# Altium schematic sheet C210_0006_Power_220601.SchDoc: C210_0006_Power
size B; Date: 2/26/2021; CompanyName: U-blox; DrawnBy: EMOO; Engineer: EMOO; Organization: U-blox; Address1: 2601 25th St. SE; Address2: Salem, OR 97302; SheetNumber: 6; SheetTotal: 7; Website: www.u-blox.com; SheetSize: B; SheetTitle: C-210 Power
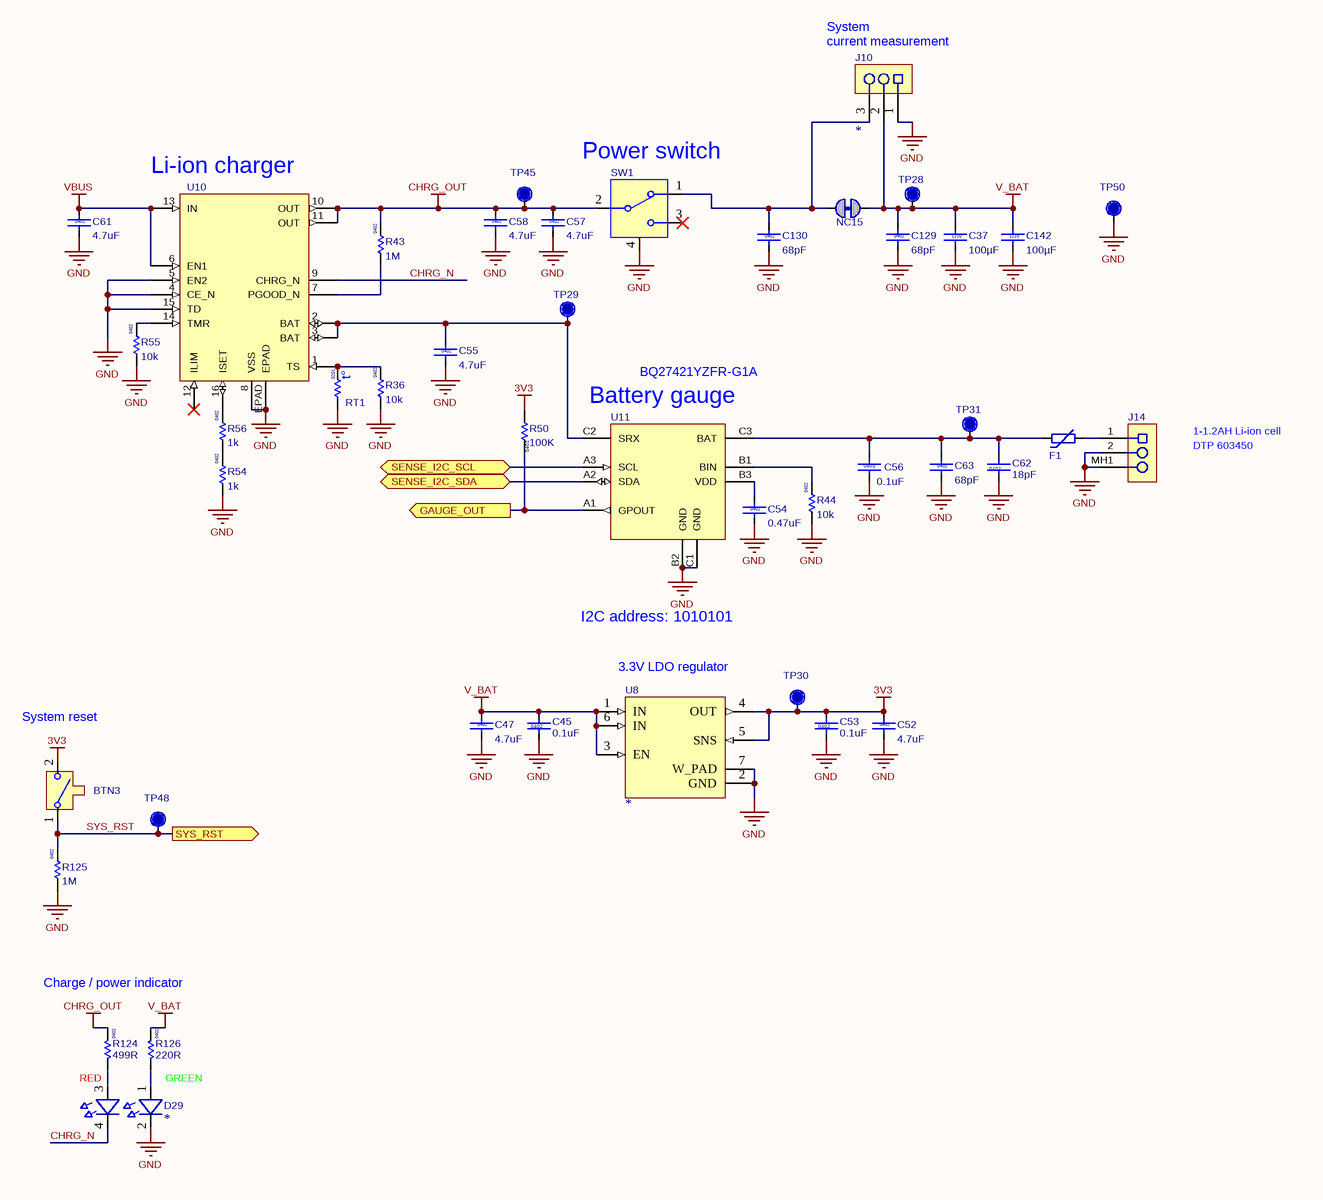
[diagram p0: C210_0006_Power_220601.SchDoc]

## Parts
?  (no value)  (graphical)
BTN3  (no value)  [B3U-3000P]
C37  value 100µF  Size: 1210  [Cap 1210]
C45  value 0.1uF  Size: 0402  [Cap 0402 HD]  (hidden comment: 120-000160.1uF)
C47  value 4.7uF  Size: 0402  [Cap 0402 HD]
C52  value 4.7uF  Size: 0402  [Cap 0402 HD]
C53  value 0.1uF  Size: 0402  [Cap 0402 HD]  (hidden comment: 120-000160.1uF)
C54  value 0.47uF  Size: 0402  [Cap 0402 HD]
C55  value 4.7uF  Size: 0402  [Cap 0402 HD]
C56  value 0.1uF  Size: 0402  [Cap 0402 HD]  (hidden comment: 120-000160.1uF)
C57  value 4.7uF  Size: 0402  [Cap 0402 HD]
C58  value 4.7uF  Size: 0402  [Cap 0402 HD]
C61  value 4.7uF  Size: 0402  [Cap 0402 HD]
C62  value 18pF  Size: 0402  [Cap 0402 HD]
C63  value 68pF  Size: 0402  [Cap 0402 HD]
C129  value 68pF  Size: 0402  [Cap 0402 HD]
C130  value 68pF  Size: 0402  [Cap 0402 HD]
C142  value 100µF  Size: 1210  [Cap 1210]
D29  (no value)  [LED_4Pin_4213_RA_3215]
F1  (no value)  [Fuse 1206]
J10  (no value)  [HDR-0.1P-3Pin-1Row-SMT]
J14  (no value)  [S2B-PH-SM4-TB]
NC15  Solderbridge-ShortDNP  [Solderbridge-Short]  (value not drawn)  (net tie, no BOM)
R36  value 10k  Size: 0402  [RES 0402 HD]
R43  value 1M  Size: 0402  [RES 0402 HD]
R44  value 10k  Size: 0402  [RES 0402 HD]
R50  value 100K  Size: 0402  [RES 0402 HD]
R54  value 1k  Size: 0402  [RES 0402 HD]
R55  value 10k  Size: 0402  [RES 0402 HD]
R56  value 1k  Size: 0402  [RES 0402 HD]
R124  value 499R  Size: 0402  [RES 0402 HD]
R125  value 1M  Size: 0402  [RES 0402 HD]
R126  value 220R  Size: 0402  [RES 0402 HD]
RT1  Size: 0201  [RES 0201 HD]  (hidden comment: Res Thermal)
SW1  (no value)  [EG1224]
TP28  TP  [TP12R]  (value not drawn)  (no BOM)
TP29  TP  [TP12R]  (value not drawn)  (no BOM)
TP30  TP  [TP12R]  (value not drawn)  (no BOM)
TP31  TP  [TP12R]  (value not drawn)  (no BOM)
TP45  TP  [TP12R]  (value not drawn)  (no BOM)
TP48  TP  [TP12R]  (value not drawn)  (no BOM)
TP50  TP  [TP12R]  (value not drawn)  (no BOM)
U8  (no value)  [DFN0.95P-6Pin_W-Pad]
U10  bq24230  [QFN0.5P3x3-16Pin_W-Pad]  (value not drawn)
U11  (no value)  [BQ27421]

## Ports
GAUGE_OUT (out), SENSE_I2C_SCL (bidir), SENSE_I2C_SDA (bidir), SYS_RST (out)

## Nets
3V3: BTN3.2 C52.1 C53.2 R50.1 TP30.1 U8.4(OUT) U8.5(SNS)
CHRG_OUT: C57.1 C58.1 R43.2 R124.2 SW1.2 TP45.1 U10.10(OUT) U10.11(OUT)
GND: C37.2 C45.1 C47.2 C52.2 C53.1 C54.2 C55.2 C56.1 C57.2 C58.2 C61.2 C62.1 C63.2 C129.2 C130.2 C142.2 D29.2(C1) J10.1 J14.2 J14.MH1 R36.1 R44.1 R54.1 R55.1 R125.1 RT1.2 SW1.4(GND) TP50.1 U8.2(GND) U8.7(W_PAD) U10.4(CE_N) U10.5(EN2) U10.8(VSS) U10.15(TD) U10.EPAD U11.B2(GND) U11.C1(GND)
V_BAT: C37.1 C45.2 C47.1 C129.1 C142.1 J10.2 NC15.1 R126.2 TP28.1 U8.1(IN) U8.3(EN) U8.6(IN)
VBUS: C61.1 U10.6(EN1) U10.13(IN)
CHRG_N: D29.4(C2) U10.9(CHRG_N)
GAUGE_OUT: R50.2 U11.A1(GPOUT) ; port GAUGE_OUT
SENSE_I2C_SCL: U11.A3(SCL) ; port SENSE_I2C_SCL
SENSE_I2C_SDA: U11.A2(SDA) ; port SENSE_I2C_SDA
SYS_RST: BTN3.1 R125.2 TP48.1 ; port SYS_RST
NetC54_1: C54.1 U11.B3(VDD)
NetC55_1: C55.1 TP29.1 U10.2(BAT) U10.3(BAT) U11.C2(SRX)
NetC56_2: C56.2 C62.2 C63.1 F1.1 TP31.1 U11.C3(BAT)
NetC130_1: C130.1 J10.3 NC15.2 SW1.1
NetD29_1: D29.1(A1) R126.1
NetD29_3: D29.3(A2) R124.1
NetF1_2: F1.2 J14.1
NetR36_2: R36.2 RT1.1 U10.1(TS)
NetR43_1: R43.1 U10.7(PGOOD_N)
NetR44_2: R44.2 U11.B1(BIN)
NetR54_2: R54.2 R56.1
NetR55_2: R55.2 U10.14(TMR)
NetR56_2: R56.2 U10.16(ISET)

Not connected (* = marked no-connect by the designer): SW1 3*; U10 12(ILIM)*

## Notes on the sheet
- System
- (near J10) current measurement
- (near SW1) Power switch
- (near U10) Li-ion charger
- BQ27421YZFR-G1A
- (near U11) Battery gauge
- DTP 603450
- 1-1.2AH Li-ion cell
- I2C address: 1010101
- (near BTN3) System reset
- (near U8) 3.3V LDO regulator
- Charge / power indicator
- RED
- GREEN
- Revision:
- Page:
- (in symbol 182-00002) t°

## Library data of the parts
? = Sub_Title_Block: Minimized schematic title block for all subset sheets
BTN3 = 135-00006: Button SPST-NO Off-MOM, 50mA 12V, Right Angle, SMT; Manufacturer 1: Omron Electronics Inc-EMC Div; Part Name: Button Tactile SPST-NO 50mA 3mm RA SMT; Body Size: 3.00mm x 2.50mm; Item Phase: In Production; Use in new designs: Yes; Voltage: 12VDC; UBX Code: None; Part Number: 135-00006; Manufacturer Part Number 1: B3U-3000P; Supplier 1: Digi-Key; Supplier Part Number 1: SW1022CT-ND; Current: 50mA; Height: 1.35mm; Max Operating Temp: 70; Min Operating Temp: -25; Pins: 2; Revision: 0A; Manufacturer 2: None; Manufacturer Part Number 2: None; Supplier 2: None; Supplier Part Number 2: None
C37 C142 = 120-00223: 100µF ±20% 10V Ceramic Capacitor X5R 1210 (3225 Metric); Manufacturer 1: Samsung Electro-Mechanics America, Inc.; Manufacturer Part Number 1: CL32A107MPVNNNE; Part Name: CAP CER 100UF 10V 20% X5R 1210; Item Phase: In Production; Tolerance: +/- 20%; Use in new designs: Yes; UBX Code: None; Part Number: 120-00223; Supplier 1: Future Electronics; Supplier Part Number 1: Samsung Electro-Mechanics America, Inc. CL32A107MPVNNNE; Manufacturer 2: None; Manufacturer Part Number 2: None; Supplier 2: None; Supplier Part Number 2: None; Height: 2.8mm; Max Operating Temp: 85; Min Operating Temp: -55; Pins: 2; Revision: 0A; Temperature Coefficient: X5R; Voltage: 10V
C45 C53 C56 = 120-00016: Cap, Ceramic 0.1uF 10V 10% X5R 0402; Part Name: CAP CER 0.1UF 10V 10% X5R 0402; Part_Type: Ceramic Capacitor; Manufacturer: Murata Electronics North America; Manufacturer P/N: GRM155R61A104KA01J; Item_Phase: Production; Component Mounting Type: SMT; Tolerance: +/- 10%; Use in new designs: Yes; Part Number: 120-00016; Revision: 0A; Supplier 1: Digi-Key; Supplier Part Number 1: 490-6297-1-ND; Manufacturer 2: Yageo; Manufacturer P/N 2: CC0402KRX5R6BB104; Supplier 2: Digi-Key; Supplier Part Number 2: 311-1336-1-ND; Arena Link: https://app.bom.com/a/GYHPV2L2L43KRMBK?v=spec.summary; Height: 0.55mm; Pins: 2; Temperature Coefficient: X5R; Voltage: 10V
C47 C52 C55 C57 C58 C61 = 120-00020: Cap, Ceramic 4.7uF 10V 20% X5R 0402; Manufacturer 1: Samsung Electro-Mechanics America, Inc; Manufacturer Part Number 1: CL05A475MP5NRNC; Part Name: CAP CER 4.7uF 10V 20% X5R 0402; Item Phase: In Production; Tolerance: +/- 20%; Use in new designs: Yes; UBX Code: None; Part Number: 120-00020; Supplier 1: Digi-Key; Supplier Part Number 1: 1276-1482-1-ND; Manufacturer 2: Yageo; Manufacturer Part Number 2: CC0402KRX5R6BB475; Supplier 2: Digi-Key; Supplier Part Number 2: 311-3477-1-ND; Height: 0.55mm; Max Operating Temp: 85; Min Operating Temp: -55; Pins: 2; Revision: 0C; Temperature Coefficient: X5R; Voltage: 10V
C54 = 120-00072: Cap, Ceramic, 0.47UF 10V 10% X5R 0402; Manufacturer 1: Murata Electronics North America; Manufacturer Part Number 1: GRM155R61A474KE15J; Part Name: CAP CER 0.47UF 10V 10% X5R 0402; Item Phase: In Production; Tolerance: +/- 10%; Use in new designs: Yes; UBX Code: None; Part Number: 120-00072; Supplier 1: Digi-Key; Supplier Part Number 1: 490-6305-1-ND; Manufacturer 2: Samsung Electro-Mechanics America, Inc; Manufacturer Part Number 2: CL05A474KP5NNNC; Supplier 2: Digi-Key; Supplier Part Number 2: 1276-1173-1-ND; Height: 0.55mm; Max Operating Temp: 85; Min Operating Temp: -55; Pins: 2; Revision: 0A; Temperature Coefficient: X5R; Voltage: 10V
C62 = 120-00041: Cap, Ceramic 18pF 50V 5% NP0 0402; Manufacturer 1: NIC Components Inc; Manufacturer Part Number 1: NMC0402NPO180J50TRPF; Part Name: CAP CER 18PF 50V 5% NP0 0402; Item Phase: In Production; Tolerance: +/- 5%; Use in new designs: Yes; UBX Code: None; Part Number: 120-00041; Supplier 1: Arrow; Supplier Part Number 1: NMC0402NPO180J50TRPF; Manufacturer 2: CCK; Manufacturer Part Number 2: CCK0402NPO5J180PL; Supplier 2: None; Supplier Part Number 2: None; Height: 0.55mm; Max Operating Temp: 125; Min Operating Temp: -55; Pins: 2; Revision: 0C; Temperature Coefficient: NP0; Voltage: 50V
C63 C129 C130 = 120-00047: Cap, Ceramic, 68pF, 50V, 1%, NP0, 0402; Manufacturer 1: Murata Electronics North America; Manufacturer Part Number 1: GRM1555C1H680FA01D; Part Name: CAP CER 68PF 50V 1% NP0 0402; Item Phase: Unreleased; Tolerance: +/- 1%; Use in new designs: Yes; UBX Code: None; Part Number: 120-00047; Supplier 1: Digi-Key; Supplier Part Number 1: 490-8219-1-ND; Manufacturer 2: AVX Corporation; Manufacturer Part Number 2: 04025A680FAT2A; Supplier 2: Digi-Key; Supplier Part Number 2: 478-7881-1-ND; Height: 0.55mm; Max Operating Temp: 125; Min Operating Temp: -55; Pins: 2; Revision: None; Temperature Coefficient: NP0; Voltage: 50V
D29 = 115-00013: Dual LED, Red/Green, Right Angle, Dome 1208; Manufacturer 1: Dialight; Manufacturer Part Number 1: 5988510207F; Part Name: LED Red/Green RA SMT 1208; Body Size: 3.2mm x 1.5mm; Current: 20mA; Item Phase: In Production; MFG Package: 1208 Bi-color; Use in new designs: Yes; Voltage: None; Color: *; Part Number: 115-00013; Supplier 1: Digi-Key; Supplier Part Number 1: 350-2072-1-ND; Height: 1.0mm; Max Operating Temp: None; Min Operating Temp: None; Pins: 4; Revision: 0A; Size: None; UBX Code: None; Manufacturer 2: None; Manufacturer Part Number 2: None; Supplier 2: None; Supplier Part Number 2: None
F1 = 190-00005: Fuse, PTC 8V, 750mA, hold, 1.5A trip, 1206; Manufacturer 1: Littelfuse; Manufacturer Part Number 1: 1206L075THYR; Part Name: Fuse PTC 8V 750mA 1206; Body Size: None; Item Phase: Unreleased; MFG Package: 1206L; Use in new designs: Yes; Part Number: 190-00005; Supplier 1: Digi-Key; Supplier Part Number 1: F3370CT-ND; Current: 750mA; Height: 0.75mm; Max Operating Temp: 85; Min Operating Temp: -40; Pins: 2; Revision: None; Size: 1206; Voltage: None; UBX Code: None
J10 = 130-00105: Header, 0.100" Pitch, 3 Pin, Vertical SMT, Black; Manufacturer 1: Harwin Inc; Manufacturer Part Number 1: M20-8770342; Part Name: CON HDR 0.1" 3 Pin 1 Row SMT; Item Phase: In Production; Use in new designs: Yes; Voltage: None; Manufacturer P/N: *; Part Number: 130-00105; Supplier 1: Digi-Key; Supplier Part Number 1: 952-1951-ND; Diameter: None; Height: 9.93mm; Max Operating Temp: None; Min Operating Temp: None; Pins: 3; Revision: 0C; UBX Code: None; Manufacturer 2: Greenconn Corporation; Manufacturer Part Number 2: GPHC1010302A081B1BD; Supplier 2: Teamwise Limited; Supplier Part Number 2: Greenconn Corporation GPHC1010302A081B1BD
J14 = S2B-PH-SM4-TB: Conn, SMT, 0.079" Pitch, 2 Pin, R/A, Black; Item Phase: In Production; Use in new designs: Yes; Voltage: None; Part Number: S2B-PH-SM4-TB; Manufacturer Part Number 1: S2B-PH-SM4-TB; Supplier 1: None; Supplier Part Number 1: None; Diameter: None; Height: 5.5mm; Max Operating Temp: None; Min Operating Temp: None; Part Name: Conn, SMT, 0.079" Pitch, 2 Pin, R/A, Black; Pins: 2; Revision: 0A; UBX Code: None; Manufacturer 2: None; Manufacturer Part Number 2: None; Supplier 2: None; Supplier Part Number 2: None; Manufacturer P/N: *
NC15 = Solderbridge-Short: Added By: Paul B; Part Number: Solderbridge-Short; Height: 0; DNP: DNP; Added Date: 12/2/2015
R36 R44 R55 = 180-00024: Resistor 10k ohm 1% 1/16W, 0402; Manufacturer 1: Samsung Electro-Mechanics America, Inc; Manufacturer Part Number 1: RC1005F103CS; Part Name: RES SMD 10K OHM 1% 1/16W 0402; Item Phase: In Production; Tolerance: +/- 1%; Use in new designs: Yes; UBX Code: None; Part Number: 180-00024; Supplier 1: Digi-Key; Supplier Part Number 1: 1276-3431-1-ND; Manufacturer 2: Hong Kong Resistors Manufactory; Manufacturer Part Number 2: RCT0210KFLF; Supplier 2: None; Supplier Part Number 2: None; Height: 0.4mm; Max Operating Temp: 155; Min Operating Temp: -55; Pins: 2; Power: 1/16W; Revision: 0E; Voltage: N/A
R43 R125 = 180-00054: Resistor 1M ohm 1%, 1/16W, 0402; Manufacturer 1: Samsung Electro-Mechanics America, Inc; Manufacturer Part Number 1: RC1005F105CS; Part Name: RES SMD 1M OHM 1% 1/16W 0402; Item Phase: In Production; Tolerance: +/- 1%; Use in new designs: Yes; Voltage: None; Part Number: 180-00054; Supplier 1: Digi-Key; Supplier Part Number 1: 1276-3433-1-ND; Manufacturer 2: Hong Kong Resistors Manufactory; Manufacturer Part Number 2: RCT021MFLF; Supplier 2: None; Supplier Part Number 2: None; Height: 0.4mm; Max Operating Temp: 155; Min Operating Temp: -55; Pins: 2; Power: 1/16W; Revision: 0D; UBX Code: None
R50 = 180-00093: Resistor 100K ohm 1% 1/16W, 0402; Manufacturer 1: Yageo; Manufacturer Part Number 1: RC0402FR-07100KL; Part Name: RES SMD 100K ohm 1% 1/16W 0402; Item Phase: In Production; Tolerance: +/- 1%; Use in new designs: Yes; Voltage: None; Part Number: 180-00093; Supplier 1: Digi-Key; Supplier Part Number 1: 311-100KLRCT-ND; Manufacturer 2: Rohm Semiconductor; Manufacturer Part Number 2: MCR01MRTF1003; Supplier 2: Digi-Key; Supplier Part Number 2: RHM100KCDCT-ND; Height: 0.4mm; Max Operating Temp: 155; Min Operating Temp: -55; Pins: 2; Power: 1/16W; Revision: 0B; UBX Code: None
R54 R56 = 180-00021: Resistor 1k ohm 1% 1/16W, 0402; Manufacturer 1: Hong Kong Resistors Manufactory; Manufacturer Part Number 1: RCT021KFLF; Part Name: RES SMD 1K OHM 1% 1/16W 0402; Item Phase: In Production; Tolerance: +/- 1%; Use in new designs: Yes; Voltage: None; Part Number: 180-00021; Supplier 1: None; Supplier Part Number 1: None; Manufacturer 2: Yageo; Manufacturer Part Number 2: RC0402FR-071KL; Supplier 2: Digi-Key; Supplier Part Number 2: 311-1.00KLRCT-ND; Height: 0.4mm; Max Operating Temp: 155; Min Operating Temp: -55; Pins: 2; Power: 1/16W; Revision: 0E; UBX Code: None
R124 = 180-00031: Resistor, 499ohm, 1%, 1/16W, 0402; Part Name: RES SMD 499 OHM 1% 1/16W 0402; Manufacturer: Rohm Semiconductor; Manufacturer P/N: MCR01MRTF4990; Item_Phase: Production; Component Mounting Type: SMT; Tolerance: +/- 1%; Use in new designs: Yes; Part Number: 180-00031; Part_Type: Resistor; Supplier 1: Digi-Key; Supplier Part Number 1: RHM499CDCT-ND; Manufacturer 2: Samsung Electro-Mechanics America, Inc; Manufacturer P/N 2: RC1005F4990CS; Arena Link: https://app.bom.com/a/Q8RZ5CVCVEDU1SS5?v=spec.summary; Height: 0.4mm; Pins: 2; Power: 1/16W; Revision: 0D; Supplier 2: Digi-Key; Supplier Part Number 2: 1276-3992-1-ND; Alternate Footprint Ref: RES 0402
R126 = 180-00098: Resistor, 220ohm, 5%, 1/16W, 0402.; Part Name: RES SMD 220 OHM 5% 1/16W 0402; Manufacturer: Panasonic Electronic Components; Manufacturer P/N: ERJ-2GEJ221X; Item_Phase: Production; Component Mounting Type: SMT; Tolerance: +/- 5%; Use in new designs: Yes; Part Number: 180-00098; Part_Type: Resistor; Supplier 1: Digi-Key; Supplier Part Number 1: P220JCT-ND; Arena Link: https://app.bom.com/a/8Q9HNUDUDWVBJC30?v=spec.summary; Pins: 2; Power: 1/16W; Revision: 0C; Manufacturer 2: Samsung Electro-Mechanics America, Inc; Manufacturer P/N 2: RC1005J221CS; Supplier 2: Digi-Key; Supplier Part Number 2: 1276-4360-1-ND; Alternate Footprint Ref: RES 0402; Height: 0.4mm
RT1 = 182-00002: Thermistor, 10Kohm, NTC 5%, 0201, 0.6mm x 0.3mm; Manufacturer 1: Murata Electronics North America; Manufacturer Part Number 1: NCP03XH103J05RL; Part Name: Thermistor 10k Ohm 5% 3380K 0201; Item Phase: Unreleased; Power: 1/20W; Tolerance: +/- 5%; Use in new designs: Yes; Value: 10k; Voltage: None; Part Number: 182-00002; Supplier 1: Digi-Key; Supplier Part Number 1: 490-4644-1-ND; Body Size: 0.6mm x 0.3mm; Height: 0.26mm; Max Operating Temp: 125; Min Operating Temp: -40; Pins: 2; Revision: None; UBX Code: None
SW1 = 137-00002: Slide switch, SPDT, 3 Pin, 500mA, 15V, Through Hole; Manufacturer 1: E-Switch; Part Name: Switch Slide SPDT 500mA 13.8mm RA TH; Item Phase: Unreleased; Use in new designs: Yes; UBX Code: None; Part Number: 137-00002; Manufacturer Part Number 1: EG1224; Supplier 1: Digi-Key; Supplier Part Number 1: EG2585-ND; Current: 500mA; Height: 8.5mm; Max Operating Temp: 70; Min Operating Temp: -20; Pins: 3; Revision: None; Voltage: 15V; Manufacturer 2: None; Manufacturer Part Number 2: None; Supplier 2: None; Supplier Part Number 2: None
TP28-TP31 TP45 TP48 TP50 = TP_R: Testpoint, Round 1.0mm Dia; Part Number: TP10R; Added By: Jeremy D; Size: 1.0mm; Height: 0; DNP: DNP; Added Date: 2/1/2015; Checked By: Paul B; Checked Date: 2/5/2015
U8 = 260-00045: IC REG LDO 3.3V 1A 6DFN; Manufacturer 1: ON Semiconductor; Body Size: 3mm x 3mm; Item Phase: Unreleased; Reg Outputs: None; MFG Package: 6-VDFN Exposed Pad; SMT Pitch: 0.95mm; Thermal Pad: Yes; Manufacturer P/N: *; Part Number: 260-00045; Manufacturer Part Number 1: NCP692MN33T2G; Supplier 1: Digi-Key; Supplier Part Number 1: NCP692MN33T2GOSTR-ND; Current: 1A; Height: 1mm; Max Operating Temp: 85; Min Operating Temp: -40; Part Name: NCP692MN33T2G; Pins: 6; Revision: None; Use in new designs: Yes; Voltage: 3.3V; UBX Code: None; Manufacturer 2: None; Manufacturer Part Number 2: None; Supplier 2: None; Supplier Part Number 2: None
U10 = bq24230: BAT CHARGER, Li-ION, SMT, USB, PWR PATH, 500mA, 4.4V, 3mmx3mm QFN-16; Manufacturer 1: Texas Instruments; Body Size: 3.3mm x 3.3mm; Item Phase: Unreleased; MFG Package: VQFN-16; SMT Pitch: 0.5mm; Use in new designs: Yes; Voltage: 5-6.5V; UBX Code: None; Part Number: bq24230; Manufacturer Part Number 1: bq24230; Supplier 1: Digi-key; Supplier Part Number 1: 296-23937-2-ND; Height: 1mm; Max Operating Temp: 85; Min Operating Temp: -40; Pins: 16; Revision: None; Size: Other; Manufacturer 2: None; Manufacturer Part Number 2: None; Supplier 2: None; Supplier Part Number 2: None
U11 = BQ27421: IC, SMT, BATTERY GAUGE, INGLE CELL Li-ION, COULOMB COUNTER, DSBGA-9 1.6mmX1.6mm; Manufacturer 1: Texas Instruments; Part Name: B39162B4353P810; Body Size: 1.4mm x 1.1mm; Current: None; Item Phase: In Production; MFG Package: QCS5P; Use in new designs: Yes; Part Number: BQ27421; Manufacturer Part Number 1: BQ27421; Height: 0.45mm; Max Operating Temp: 85; Min Operating Temp: -40; Pins: 5; Revision: 0A; Voltage: N/A; UBX Code: None